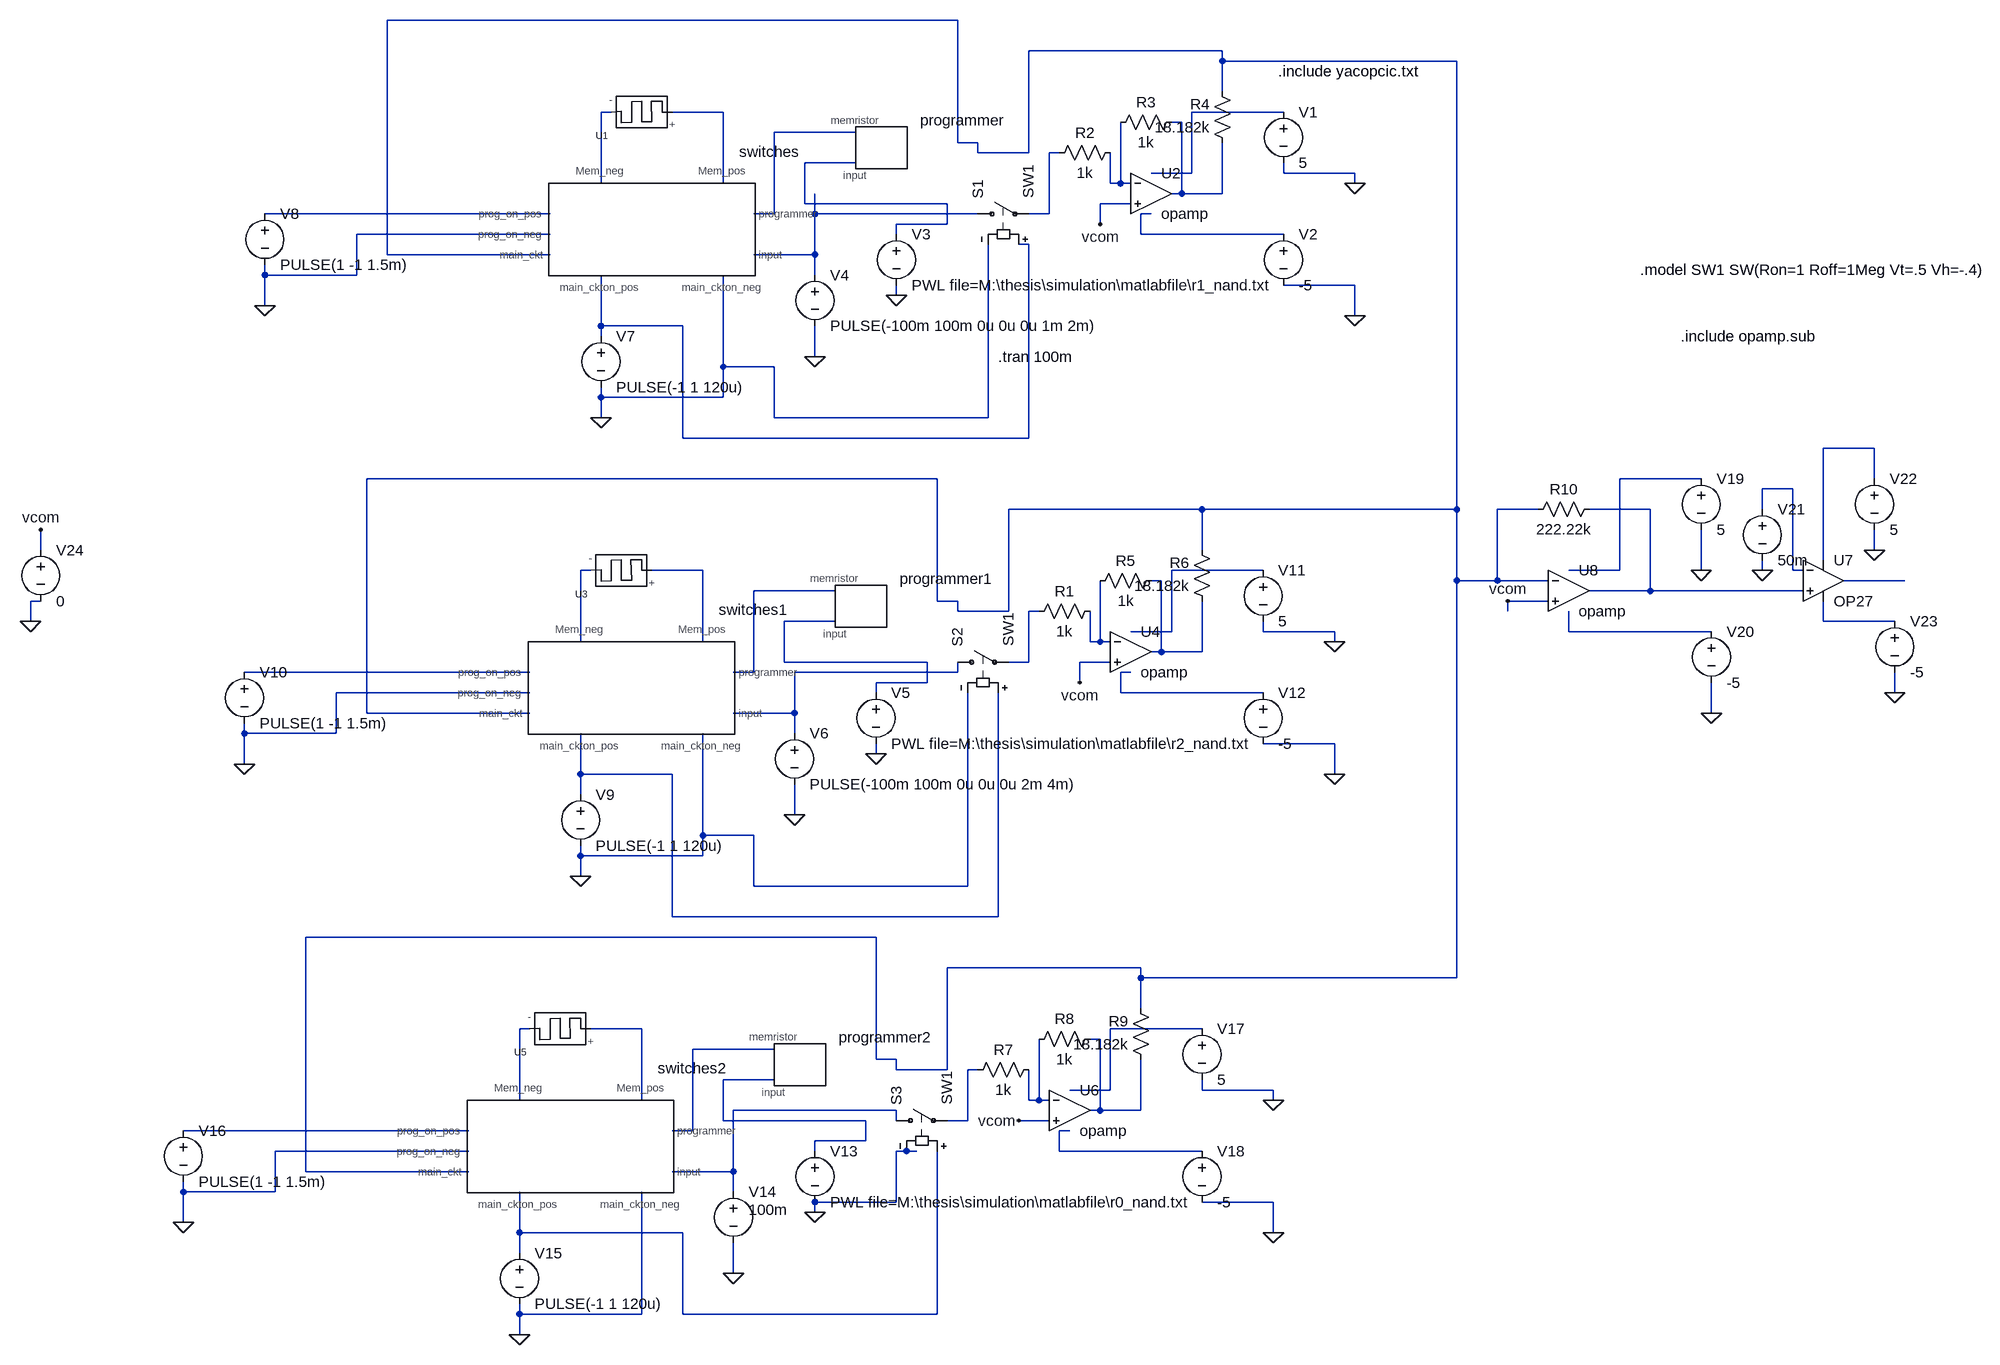
[diagram p0: schematic trial_2.asc]
trial_2.asc, the LTspice schematic file:
Version 4
SHEET 1 1276 680
WIRE -416 -1408 -1312 -1408
WIRE 0 -1360 -304 -1360
WIRE 0 -1344 0 -1360
WIRE 368 -1344 0 -1344
WIRE 0 -1296 0 -1344
WIRE -960 -1264 -976 -1264
WIRE -784 -1264 -864 -1264
WIRE 96 -1264 -48 -1264
WIRE -64 -1248 -80 -1248
WIRE -576 -1232 -704 -1232
WIRE -416 -1216 -416 -1408
WIRE -384 -1216 -416 -1216
WIRE -384 -1200 -384 -1216
WIRE -304 -1200 -304 -1360
WIRE -304 -1200 -384 -1200
WIRE -256 -1200 -272 -1200
WIRE -576 -1184 -656 -1184
WIRE -48 -1168 -48 -1264
WIRE -48 -1168 -112 -1168
WIRE 96 -1168 96 -1184
WIRE 208 -1168 96 -1168
WIRE -976 -1152 -976 -1264
WIRE -784 -1152 -784 -1264
WIRE -176 -1152 -176 -1200
WIRE -160 -1152 -160 -1248
WIRE -160 -1152 -176 -1152
WIRE -144 -1152 -160 -1152
WIRE 208 -1152 208 -1168
WIRE -64 -1136 -64 -1248
WIRE -64 -1136 -80 -1136
WIRE 0 -1136 0 -1216
WIRE 0 -1136 -64 -1136
WIRE -656 -1120 -656 -1184
WIRE -432 -1120 -656 -1120
WIRE -144 -1120 -192 -1120
WIRE -1056 -1104 -1504 -1104
WIRE -704 -1104 -704 -1232
WIRE -704 -1104 -736 -1104
WIRE -640 -1104 -640 -1136
WIRE -384 -1104 -640 -1104
WIRE -272 -1104 -272 -1200
WIRE -272 -1104 -304 -1104
WIRE -112 -1104 -128 -1104
WIRE -432 -1088 -432 -1120
WIRE -432 -1088 -512 -1088
WIRE -192 -1088 -192 -1120
WIRE -1056 -1072 -1360 -1072
WIRE -512 -1072 -512 -1088
WIRE -128 -1072 -128 -1104
WIRE 96 -1072 -128 -1072
WIRE -304 -1056 -320 -1056
WIRE -1312 -1040 -1312 -1408
WIRE -1056 -1040 -1312 -1040
WIRE -640 -1040 -640 -1104
WIRE -640 -1040 -736 -1040
WIRE -1504 -1008 -1504 -1024
WIRE -1360 -1008 -1360 -1072
WIRE -1360 -1008 -1504 -1008
WIRE -640 -1008 -640 -1040
WIRE 208 -992 96 -992
WIRE -512 -976 -512 -992
WIRE -1504 -960 -1504 -1008
WIRE 208 -944 208 -992
WIRE -976 -928 -976 -1008
WIRE -848 -928 -976 -928
WIRE -976 -912 -976 -928
WIRE -640 -880 -640 -928
WIRE -784 -864 -784 -1008
WIRE -704 -864 -784 -864
WIRE -976 -816 -976 -832
WIRE -784 -816 -784 -864
WIRE -784 -816 -976 -816
WIRE -976 -784 -976 -816
WIRE -704 -784 -704 -864
WIRE -368 -784 -368 -1056
WIRE -368 -784 -704 -784
WIRE -848 -752 -848 -928
WIRE -304 -752 -304 -1056
WIRE -304 -752 -848 -752
WIRE 1024 -736 944 -736
WIRE -448 -688 -1344 -688
WIRE 752 -688 624 -688
WIRE 1024 -688 1024 -736
WIRE 896 -672 848 -672
WIRE -32 -640 -336 -640
WIRE 368 -640 368 -1344
WIRE 368 -640 -32 -640
WIRE 496 -640 432 -640
WIRE 672 -640 576 -640
WIRE 848 -640 848 -672
WIRE -1856 -576 -1856 -608
WIRE -32 -576 -32 -640
WIRE 1024 -576 1024 -608
WIRE 944 -560 944 -736
WIRE -992 -544 -1008 -544
WIRE -816 -544 -896 -544
WIRE 64 -544 -80 -544
WIRE 624 -544 624 -688
WIRE 624 -544 544 -544
WIRE 752 -544 752 -608
WIRE 848 -544 848 -560
WIRE 896 -544 896 -672
WIRE 912 -544 896 -544
WIRE -96 -528 -112 -528
WIRE 368 -528 368 -640
WIRE 432 -528 432 -640
WIRE 432 -528 368 -528
WIRE 512 -528 432 -528
WIRE 1072 -528 976 -528
WIRE -608 -512 -736 -512
WIRE 672 -512 672 -640
WIRE 672 -512 576 -512
WIRE 912 -512 672 -512
WIRE -1856 -496 -1872 -496
WIRE -448 -496 -448 -688
WIRE -416 -496 -448 -496
WIRE 512 -496 448 -496
WIRE -416 -480 -416 -496
WIRE -336 -480 -336 -640
WIRE -336 -480 -416 -480
WIRE -288 -480 -304 -480
WIRE 448 -480 448 -496
WIRE -1872 -464 -1872 -496
WIRE -608 -464 -688 -464
WIRE 944 -464 944 -496
WIRE 1056 -464 944 -464
WIRE -80 -448 -80 -544
WIRE -80 -448 -144 -448
WIRE 64 -448 64 -464
WIRE 176 -448 64 -448
WIRE 544 -448 544 -480
WIRE 768 -448 544 -448
WIRE -1008 -432 -1008 -544
WIRE -816 -432 -816 -544
WIRE -208 -432 -208 -480
WIRE -192 -432 -192 -528
WIRE -192 -432 -208 -432
WIRE -176 -432 -192 -432
WIRE 176 -432 176 -448
WIRE -96 -416 -96 -528
WIRE -96 -416 -112 -416
WIRE -32 -416 -32 -496
WIRE -32 -416 -96 -416
WIRE -688 -400 -688 -464
WIRE -464 -400 -688 -400
WIRE -304 -400 -304 -480
WIRE -304 -400 -336 -400
WIRE -176 -400 -224 -400
WIRE -1088 -384 -1536 -384
WIRE -736 -384 -736 -512
WIRE -736 -384 -768 -384
WIRE -416 -384 -416 -400
WIRE -416 -384 -672 -384
WIRE -144 -384 -160 -384
WIRE -464 -368 -464 -400
WIRE -464 -368 -544 -368
WIRE -224 -368 -224 -400
WIRE -1088 -352 -1392 -352
WIRE -544 -352 -544 -368
WIRE -160 -352 -160 -384
WIRE 64 -352 -160 -352
WIRE 1056 -352 1056 -384
WIRE -1344 -320 -1344 -688
WIRE -1088 -320 -1344 -320
WIRE -672 -320 -672 -384
WIRE -672 -320 -768 -320
WIRE 768 -320 768 -368
WIRE -1536 -288 -1536 -304
WIRE -1392 -288 -1392 -352
WIRE -1392 -288 -1536 -288
WIRE -672 -288 -672 -320
WIRE 176 -272 64 -272
WIRE -544 -256 -544 -272
WIRE -1536 -240 -1536 -288
WIRE -1008 -224 -1008 -288
WIRE -864 -224 -1008 -224
WIRE 176 -224 176 -272
WIRE -1008 -192 -1008 -224
WIRE -672 -160 -672 -208
WIRE -816 -128 -816 -288
WIRE -736 -128 -816 -128
WIRE -1008 -96 -1008 -112
WIRE -816 -96 -816 -128
WIRE -816 -96 -1008 -96
WIRE -1008 -64 -1008 -96
WIRE -736 -48 -736 -128
WIRE -400 -48 -400 -352
WIRE -400 -48 -736 -48
WIRE -864 0 -864 -224
WIRE -352 0 -352 -352
WIRE -352 0 -864 0
WIRE -544 32 -1440 32
WIRE -128 80 -432 80
WIRE -128 96 -128 80
WIRE 368 96 368 -528
WIRE 368 96 -128 96
WIRE -128 144 -128 96
WIRE -1088 176 -1104 176
WIRE -912 176 -992 176
WIRE -32 176 -176 176
WIRE -192 192 -208 192
WIRE -704 208 -832 208
WIRE -544 224 -544 32
WIRE -512 224 -544 224
WIRE -512 240 -512 224
WIRE -432 240 -432 80
WIRE -432 240 -512 240
WIRE -384 240 -400 240
WIRE -704 256 -784 256
WIRE -176 272 -176 176
WIRE -176 272 -240 272
WIRE -32 272 -32 256
WIRE 80 272 -32 272
WIRE -1104 288 -1104 176
WIRE -912 288 -912 176
WIRE -304 288 -304 240
WIRE -288 288 -288 192
WIRE -288 288 -304 288
WIRE -272 288 -288 288
WIRE 80 288 80 272
WIRE -512 304 -768 304
WIRE -192 304 -192 192
WIRE -192 304 -208 304
WIRE -128 304 -128 224
WIRE -128 304 -192 304
WIRE -784 320 -784 256
WIRE -560 320 -784 320
WIRE -512 320 -512 304
WIRE -400 320 -400 240
WIRE -400 320 -432 320
WIRE -272 320 -320 320
WIRE -1184 336 -1632 336
WIRE -832 336 -832 208
WIRE -832 336 -864 336
WIRE -240 336 -256 336
WIRE -560 352 -560 320
WIRE -560 352 -640 352
WIRE -1184 368 -1488 368
WIRE -640 368 -640 352
WIRE -496 368 -512 368
WIRE -480 368 -496 368
WIRE -256 368 -256 336
WIRE -32 368 -256 368
WIRE -1440 400 -1440 32
WIRE -1184 400 -1440 400
WIRE -768 400 -768 304
WIRE -768 400 -864 400
WIRE -1632 432 -1632 416
WIRE -1488 432 -1488 368
WIRE -1488 432 -1632 432
WIRE -768 432 -768 400
WIRE -512 448 -512 368
WIRE -512 448 -640 448
WIRE 80 448 -32 448
WIRE -640 464 -640 448
WIRE -1632 480 -1632 432
WIRE -1104 496 -1104 432
WIRE -848 496 -1104 496
WIRE 80 496 80 448
WIRE -1104 528 -1104 496
WIRE -768 560 -768 512
WIRE -1104 624 -1104 608
WIRE -912 624 -912 432
WIRE -912 624 -1104 624
WIRE -848 624 -848 496
WIRE -448 624 -448 368
WIRE -448 624 -848 624
WIRE -1104 656 -1104 624
FLAG -512 -976 0
FLAG -640 -880 0
FLAG -976 -784 0
FLAG -1504 -960 0
FLAG 208 -1152 0
FLAG 208 -944 0
FLAG -544 -256 0
FLAG -672 -160 0
FLAG -1008 -64 0
FLAG -1536 -240 0
FLAG 176 -432 0
FLAG 176 -224 0
FLAG -640 464 0
FLAG -768 560 0
FLAG -1104 656 0
FLAG -1632 480 0
FLAG 80 288 0
FLAG 80 496 0
FLAG -1872 -464 0
FLAG 752 -544 0
FLAG 768 -320 0
FLAG 848 -544 0
FLAG 1056 -352 0
FLAG 1024 -576 0
FLAG -1856 -608 vcom
FLAG -192 -1088 vcom
FLAG -224 -368 vcom
FLAG -320 320 vcom
FLAG 448 -496 vcom
SYMBOL memristormodel -944 -1264 R180
SYMATTR InstName U1
SYMATTR Value MEM_YAKOPCIC
SYMBOL voltage -512 -1088 R0
WINDOW 123 0 0 Left 2
WINDOW 39 0 0 Left 2
SYMATTR InstName V3
SYMATTR Value PWL file=M:\thesis\simulation\matlabfile\r1_nand.txt
SYMBOL voltage -640 -1024 R0
WINDOW 123 0 0 Left 2
WINDOW 39 0 0 Left 2
SYMATTR InstName V4
SYMATTR Value PULSE(-100m 100m 0u 0u 0u 1m 2m)
SYMBOL voltage -976 -928 R0
WINDOW 123 0 0 Left 2
WINDOW 39 0 0 Left 2
SYMATTR InstName V7
SYMATTR Value PULSE(-1 1 120u)
SYMBOL voltage -1504 -1120 R0
WINDOW 123 0 0 Left 2
WINDOW 39 0 0 Left 2
SYMATTR InstName V8
SYMATTR Value PULSE(1 -1 1.5m)
SYMBOL programmer_block -528 -1184 R0
SYMATTR InstName programmer
SYMBOL switch_block -976 -1104 R0
SYMATTR InstName switches
SYMBOL voltage 96 -1280 R0
WINDOW 123 0 0 Left 2
WINDOW 39 0 0 Left 2
SYMATTR InstName V1
SYMATTR Value 5
SYMBOL voltage 96 -1088 R0
WINDOW 123 0 0 Left 2
WINDOW 39 0 0 Left 2
SYMATTR InstName V2
SYMATTR Value -5
SYMBOL res -160 -1216 R90
WINDOW 0 0 56 VBottom 2
WINDOW 3 32 56 VTop 2
SYMATTR InstName R2
SYMATTR Value 1k
SYMBOL res -64 -1264 R90
WINDOW 0 0 56 VBottom 2
WINDOW 3 32 56 VTop 2
SYMATTR InstName R3
SYMATTR Value 1k
SYMBOL res 16 -1200 R180
WINDOW 0 36 76 Left 2
WINDOW 3 36 40 Left 2
SYMATTR InstName R4
SYMATTR Value 18.182k
SYMBOL memristormodel -976 -544 R180
SYMATTR InstName U3
SYMATTR Value MEM_YAKOPCIC
SYMBOL voltage -544 -368 R0
WINDOW 123 0 0 Left 2
WINDOW 39 0 0 Left 2
SYMATTR InstName V5
SYMATTR Value PWL file=M:\thesis\simulation\matlabfile\r2_nand.txt
SYMBOL voltage -672 -304 R0
WINDOW 123 0 0 Left 2
WINDOW 39 0 0 Left 2
SYMATTR InstName V6
SYMATTR Value PULSE(-100m 100m 0u 0u 0u 2m 4m)
SYMBOL voltage -1008 -208 R0
WINDOW 123 0 0 Left 2
WINDOW 39 0 0 Left 2
SYMATTR InstName V9
SYMATTR Value PULSE(-1 1 120u)
SYMBOL voltage -1536 -400 R0
WINDOW 123 0 0 Left 2
WINDOW 39 0 0 Left 2
SYMATTR InstName V10
SYMATTR Value PULSE(1 -1 1.5m)
SYMBOL programmer_block -560 -464 R0
SYMATTR InstName programmer1
SYMBOL switch_block -1008 -384 R0
SYMATTR InstName switches1
SYMBOL voltage 64 -560 R0
WINDOW 123 0 0 Left 2
WINDOW 39 0 0 Left 2
SYMATTR InstName V11
SYMATTR Value 5
SYMBOL voltage 64 -368 R0
WINDOW 123 0 0 Left 2
WINDOW 39 0 0 Left 2
SYMATTR InstName V12
SYMATTR Value -5
SYMBOL res -192 -496 R90
WINDOW 0 0 56 VBottom 2
WINDOW 3 32 56 VTop 2
SYMATTR InstName R1
SYMATTR Value 1k
SYMBOL res -96 -544 R90
WINDOW 0 0 56 VBottom 2
WINDOW 3 32 56 VTop 2
SYMATTR InstName R5
SYMATTR Value 1k
SYMBOL res -16 -480 R180
WINDOW 0 36 76 Left 2
WINDOW 3 36 40 Left 2
SYMATTR InstName R6
SYMATTR Value 18.182k
SYMBOL memristormodel -1072 176 R180
SYMATTR InstName U5
SYMATTR Value MEM_YAKOPCIC
SYMBOL voltage -640 352 R0
WINDOW 123 0 0 Left 2
WINDOW 39 0 0 Left 2
SYMATTR InstName V13
SYMATTR Value PWL file=M:\thesis\simulation\matlabfile\r0_nand.txt
SYMBOL voltage -768 416 R0
WINDOW 123 0 0 Left 2
WINDOW 39 0 0 Left 2
WINDOW 3 24 44 Left 2
SYMATTR Value 100m
SYMATTR InstName V14
SYMBOL voltage -1104 512 R0
WINDOW 123 0 0 Left 2
WINDOW 39 0 0 Left 2
SYMATTR InstName V15
SYMATTR Value PULSE(-1 1 120u)
SYMBOL voltage -1632 320 R0
WINDOW 123 0 0 Left 2
WINDOW 39 0 0 Left 2
SYMATTR InstName V16
SYMATTR Value PULSE(1 -1 1.5m)
SYMBOL programmer_block -656 256 R0
SYMATTR InstName programmer2
SYMBOL switch_block -1104 336 R0
SYMATTR InstName switches2
SYMBOL voltage -32 160 R0
WINDOW 123 0 0 Left 2
WINDOW 39 0 0 Left 2
SYMATTR InstName V17
SYMATTR Value 5
SYMBOL voltage -32 352 R0
WINDOW 123 0 0 Left 2
WINDOW 39 0 0 Left 2
SYMATTR InstName V18
SYMATTR Value -5
SYMBOL res -288 224 R90
WINDOW 0 0 56 VBottom 2
WINDOW 3 32 56 VTop 2
SYMATTR InstName R7
SYMATTR Value 1k
SYMBOL res -192 176 R90
WINDOW 0 0 56 VBottom 2
WINDOW 3 32 56 VTop 2
SYMATTR InstName R8
SYMATTR Value 1k
SYMBOL res -112 240 R180
WINDOW 0 36 76 Left 2
WINDOW 3 36 40 Left 2
SYMATTR InstName R9
SYMATTR Value 18.182k
SYMBOL res 592 -656 R90
WINDOW 0 0 56 VBottom 2
WINDOW 3 32 56 VTop 2
SYMATTR InstName R10
SYMATTR Value 222.22k
SYMBOL voltage 752 -704 R0
WINDOW 123 0 0 Left 2
WINDOW 39 0 0 Left 2
SYMATTR InstName V19
SYMATTR Value 5
SYMBOL voltage 768 -464 R0
WINDOW 123 0 0 Left 2
WINDOW 39 0 0 Left 2
SYMATTR InstName V20
SYMATTR Value -5
SYMBOL sw -400 -1104 R270
SYMATTR InstName S1
SYMATTR Value SW1
SYMBOL sw -432 -400 R270
SYMATTR InstName S2
SYMATTR Value SW1
SYMBOL sw -528 320 R270
SYMATTR InstName S3
SYMATTR Value SW1
SYMBOL voltage 848 -656 R0
WINDOW 123 0 0 Left 2
WINDOW 39 0 0 Left 2
SYMATTR InstName V21
SYMATTR Value 50m
SYMBOL voltage 1024 -704 R0
WINDOW 123 0 0 Left 2
WINDOW 39 0 0 Left 2
SYMATTR InstName V22
SYMATTR Value 5
SYMBOL voltage 1056 -480 R0
WINDOW 123 0 0 Left 2
WINDOW 39 0 0 Left 2
SYMATTR InstName V23
SYMATTR Value -5
SYMBOL voltage -1856 -592 R0
WINDOW 123 0 0 Left 2
WINDOW 39 0 0 Left 2
SYMATTR InstName V24
SYMATTR Value 0
SYMBOL Opamps\\opamp -112 -1200 R0
SYMATTR InstName U2
SYMBOL Opamps\\opamp -144 -480 R0
SYMATTR InstName U4
SYMBOL Opamps\\opamp -240 240 R0
SYMATTR InstName U6
SYMBOL Opamps\\opamp 544 -576 R0
SYMATTR InstName U8
SYMBOL Opamps\\OP27 944 -592 R0
SYMATTR InstName U7
TEXT -352 -880 Left 2 !.tran 100m
TEXT 88 -1328 Left 2 !.include yacopcic.txt
TEXT 656 -1016 Left 2 !.model SW1 SW(Ron=1 Roff=1Meg Vt=.5 Vh=-.4)
TEXT 720 -912 Left 2 !.include opamp.sub

The netlist it stands for:
* trial_2.asc
XU1 N003 N002 M MEM_YAKOPCIC  ; pins + -
V3 N008 0 PWL file=M:\thesis\simulation\matlabfile\r1_nand.txt
V4 N011 0 PULSE(-100m 100m 0u 0u 0u 1m 2m)
V7 N013 0 PULSE(-1 1 120u)
V8 N010 0 PULSE(1 -1 1.5m)
Xprogrammer N006 N008 programmer_block  ; pins memristor input
Xswitches N002 N003 N010 0 N001 N013 0 N006 N011 switch_block  ; pins Mem_neg Mem_pos prog_on_pos prog_on_neg main_ckt main_ckton_pos main_ckton_neg programmer input
V1 N004 0 5
V2 N012 0 -5
R2 N009 N007 1k
R3 N005 N009 1k
R4 N005 N001 18.182k
XU3 N019 N018 M MEM_YAKOPCIC  ; pins + -
V5 N025 0 PWL file=M:\thesis\simulation\matlabfile\r2_nand.txt
V6 N030 0 PULSE(-100m 100m 0u 0u 0u 2m 4m)
V9 N032 0 PULSE(-1 1 120u)
V10 N029 0 PULSE(1 -1 1.5m)
Xprogrammer1 N023 N025 programmer_block  ; pins memristor input
Xswitches1 N018 N019 N029 0 N001 N032 0 N023 N030 switch_block  ; pins Mem_neg Mem_pos prog_on_pos prog_on_neg main_ckt main_ckton_pos main_ckton_neg programmer input
V11 N020 0 5
V12 N031 0 -5
R1 N028 N024 1k
R5 N021 N028 1k
R6 N021 N001 18.182k
XU5 N034 N033 M MEM_YAKOPCIC  ; pins + -
V13 N039 0 PWL file=M:\thesis\simulation\matlabfile\r0_nand.txt
V14 N041 0 100m
V15 N044 0 PULSE(-1 1 120u)
V16 N042 0 PULSE(1 -1 1.5m)
Xprogrammer2 N037 N039 programmer_block  ; pins memristor input
Xswitches2 N033 N034 N042 0 N001 N044 0 N037 N041 switch_block  ; pins Mem_neg Mem_pos prog_on_pos prog_on_neg main_ckt main_ckton_pos main_ckton_neg programmer input
V17 N035 0 5
V18 N043 0 -5
R7 N040 N038 1k
R8 N036 N040 1k
R9 N036 N001 18.182k
R10 N017 N001 222.22k
V19 N015 0 5
V20 N027 0 -5
S1 N011 N007 N013 0 SW1
S2 N030 N024 N032 0 SW1
S3 N041 N038 N044 0 SW1
V21 N016 0 50m
V22 N014 0 5
V23 N026 0 -5
V24 vcom 0 0
XU2 N009 vcom N005 opamp Aol=100K GBW=10Meg  ; pins invin noninvin out
XU4 N028 vcom N021 opamp Aol=100K GBW=10Meg  ; pins invin noninvin out
XU6 N040 vcom N036 opamp Aol=100K GBW=10Meg  ; pins invin noninvin out
XU8 N001 vcom N017 opamp Aol=100K GBW=10Meg  ; pins invin noninvin out
XU7 N017 N016 N014 N026 N022 OP27  ; pins In+ In- V+ V- OUT
.tran 100m
.include yacopcic.txt
.model SW1 SW(Ron=1 Roff=1Meg Vt=.5 Vh=-.4)
.include opamp.sub
.lib ADI.lib
.backanno
.end